# Altium schematic sheet power.SchDoc
size A4; SheetNumber: 3; SheetTotal: 8
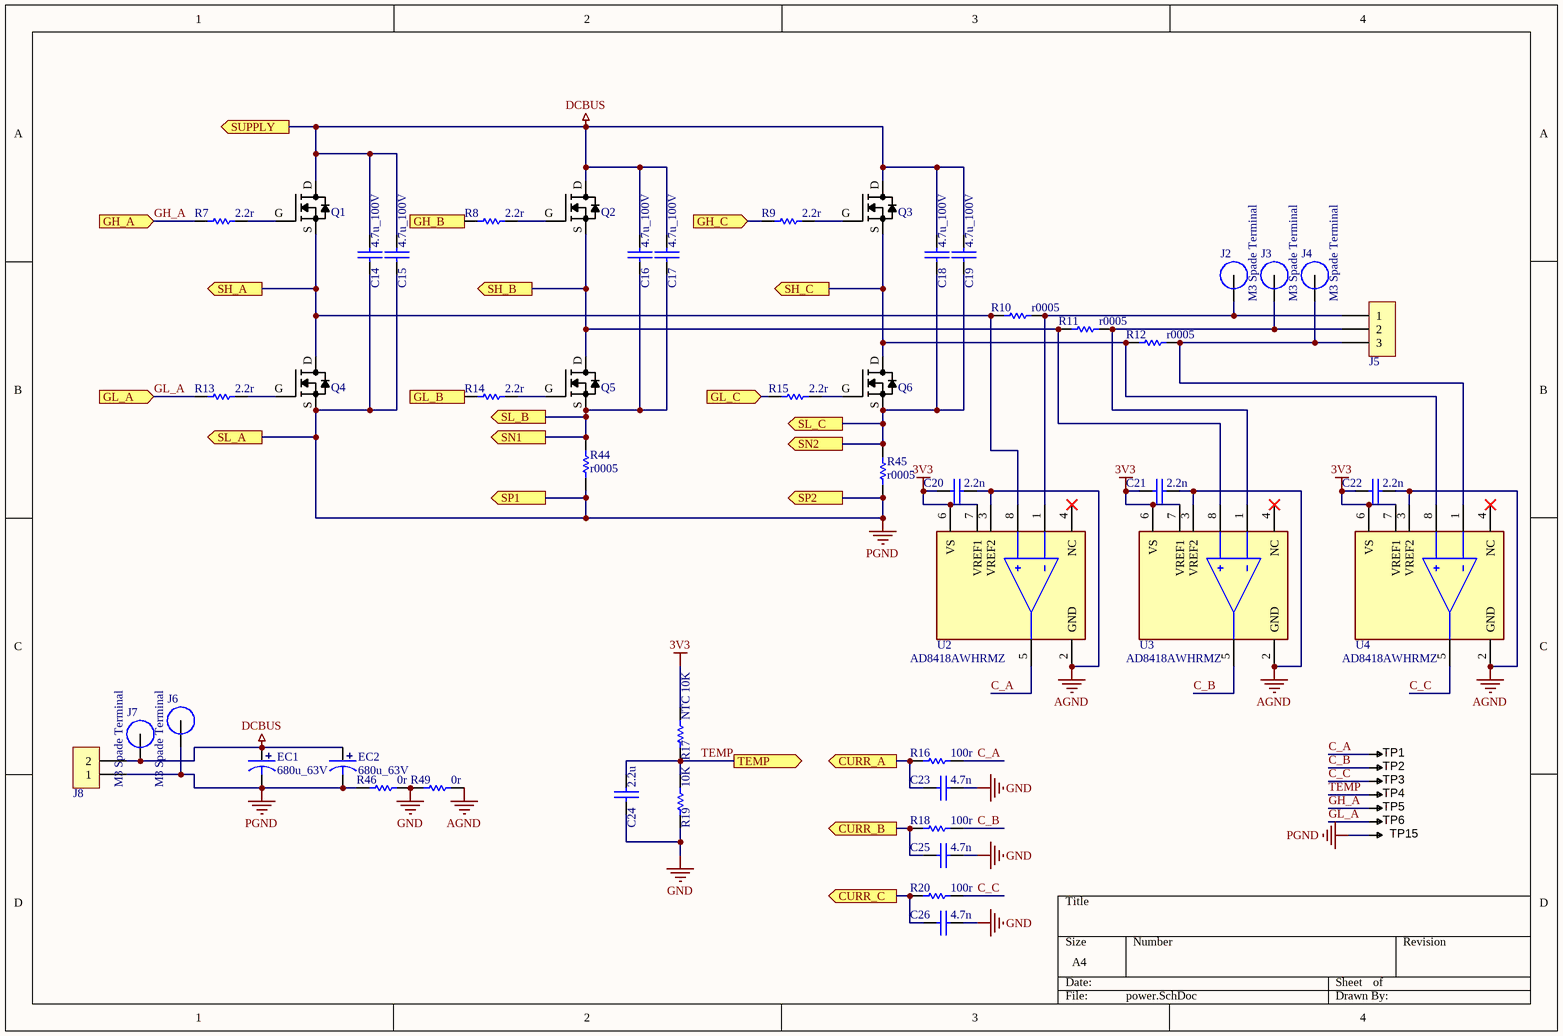
[diagram p0: power.SchDoc]

## Parts
C14  4.7u_100V  [1206C]
C15  4.7u_100V  [1206C]
C16  4.7u_100V  [1206C]
C17  4.7u_100V  [1206C]
C18  4.7u_100V  [1206C]
C19  4.7u_100V  [1206C]
C20  2.2n  [0603C]
C21  2.2n  [0603C]
C22  2.2n  [0603C]
C23  4.7n  [0603C]
C24  2.2u  [0603C]
C25  4.7n  [0603C]
C26  4.7n  [0603C]
EC1  680u_63V  [DIP-EC5.0X12.5X25]
EC2  680u_63V  [DIP-EC5.0X12.5X25]
J2  M3 Spade Terminal  [M3 Spade Hole]
J3  M3 Spade Terminal  [M3 Spade Hole]
J4  M3 Spade Terminal  [M3 Spade Hole]
J5  1704936  [1704936]  (value not drawn)
J6  M3 Spade Terminal  [M3 Spade Hole]
J7  M3 Spade Terminal  [M3 Spade Hole]
J8  1868076  [1868076]  (value not drawn)
Q1  FILL_FOOTPRINT  [SO8FL_VIAS]  (value not drawn)
Q2  FILL_FOOTPRINT  [SO8FL_VIAS]  (value not drawn)
Q3  FILL_FOOTPRINT  [SO8FL_VIAS]  (value not drawn)
Q4  FILL_FOOTPRINT  [SO8FL_VIAS]  (value not drawn)
Q5  FILL_FOOTPRINT  [SO8FL_VIAS]  (value not drawn)
Q6  FILL_FOOTPRINT  [SO8FL_VIAS]  (value not drawn)
R7  2.2r  [0603R]
R8  2.2r  [0603R]
R9  2.2r  [0603R]
R10  r0005  [2512R]
R11  r0005  [2512R]
R12  r0005  [2512R]
R13  2.2r  [0603R]
R14  2.2r  [0603R]
R15  2.2r  [0603R]
R16  100r  [0603R]
R17  NTC 10K  [0603R]
R18  100r  [0603R]
R19  10K  [0603R]
R20  100r  [0603R]
R44  r0005  [2512R]
R45  r0005  [2512R]
R46  0r  [0603R]
R49  0r  [0603R]
TP1  TESTPOINT  [FIDUCIAL]  (value not drawn)  (no BOM)
TP2  TESTPOINT  [FIDUCIAL]  (value not drawn)  (no BOM)
TP3  TESTPOINT  [FIDUCIAL]  (value not drawn)  (no BOM)
TP4  TESTPOINT  [FIDUCIAL]  (value not drawn)  (no BOM)
TP5  TESTPOINT  [FIDUCIAL]  (value not drawn)  (no BOM)
TP6  TESTPOINT  [FIDUCIAL]  (value not drawn)  (no BOM)
TP15  TESTPOINT  [FIDUCIAL]  (value not drawn)  (no BOM)
U2  AD8418AWHRMZ  [FP-RM-8-IPC_A]
U3  AD8418AWHRMZ  [FP-RM-8-IPC_A]
U4  AD8418AWHRMZ  [FP-RM-8-IPC_A]

## Ports
CURR_A (out), CURR_B (out), CURR_C (out), GH_A (in), GH_B (in), GH_C (in), GL_A (in), GL_B (in), GL_C (in), SH_A (out), SH_B (out), SH_C (out), SL_A (out), SL_B (out), SL_C (out), SN1 (out), SN2 (out), SP1 (out), SP2 (out), SUPPLY (out), TEMP (out)

## Nets
3V3: C20.2 C21.2 C22.2 R17.2 U2.6(VS) U2.7(VREF1) U3.6(VS) U3.7(VREF1) U4.6(VS) U4.7(VREF1)
AGND: C20.1 C21.1 C22.1 R49.1 U2.2(GND) U2.3(VREF2) U3.2(GND) U3.3(VREF2) U4.2(GND) U4.3(VREF2)
DCBUS: C14.2 C15.2 C16.2 C17.2 C18.2 C19.2 EC1.1 EC2.1 J7.1 J8.2 Q1.D Q2.D Q3.D ; port SUPPLY
GND: C23.1 C24.1 C25.1 C26.1 R19.1 R46.1 R49.2
PGND: C14.1 C15.1 EC1.2 EC2.2 J6.1 J8.1 Q4.S R44.2 R45.2 R46.2 TP15.1 ; port SL_A, port SP1, port SP2
C_A: R16.1 TP1.1 U2.5(OUT)
C_B: R18.1 TP2.1 U3.5(OUT)
C_C: R20.1 TP3.1 U4.5(OUT)
CURR_A: C23.2 R16.2 ; port CURR_A
CURR_B: C25.2 R18.2 ; port CURR_B
CURR_C: C26.2 R20.2 ; port CURR_C
GH_A: R7.1 TP5.1 ; port GH_A
GH_B: R8.1 ; port GH_B
GH_C: R9.1 ; port GH_C
GL_A: R13.1 TP6.1 ; port GL_A
GL_B: R14.1 ; port GL_B
GL_C: R15.1 ; port GL_C
SH_A: Q1.S Q4.D R10.2 U2.8(+IN) ; port SH_A
SH_B: Q2.S Q5.D R11.2 U3.8(+IN) ; port SH_B
SH_C: Q3.S Q6.D R12.2 U4.8(+IN) ; port SH_C
SL_B: C16.1 C17.1 Q5.S R44.1 ; port SL_B, port SN1
SL_C: C18.1 C19.1 Q6.S R45.1 ; port SL_C, port SN2
TEMP: C24.2 R17.1 R19.2 TP4.1 ; port TEMP
NetJ2_1: J2.1 J5.1 R10.1 U2.1(-IN)
NetJ3_1: J3.1 J5.2 R11.1 U3.1(-IN)
NetJ4_1: J4.1 J5.3 R12.1 U4.1(-IN)
NetQ1_G: Q1.G R7.2
NetQ2_G: Q2.G R8.2
NetQ3_G: Q3.G R9.2
NetQ4_G: Q4.G R13.2
NetQ5_G: Q5.G R14.2
NetQ6_G: Q6.G R15.2

Not connected (* = marked no-connect by the designer): U2 4(NC)*; U3 4(NC)*; U4 4(NC)*

## Library data of the parts
C14-C26 = CAP: 无极性电容
EC1 EC2 = DIP_ECAP: 直插电解电容
J5 = 1704936: CONN TERM BLOCK 3POS 7.62MM; Manufacturer: Phoenix Contact; Number of Levels: 1; Positions Per Level: 3; Pitch: 0.300" (7.62mm); Mating Orientation: Horizontal with Board; Current: 30A; Voltage: 300V; Wire Gauge: 10-30 AWG; Wire Termination: Screw - Rising Cage Clamp; Torque - Screw: 0.5-0.6 Nm (4.4-5.3 Lb-In); Screw Thread: M3; Supplier 1: Digi-Key; Supplier Part Number 1: 277-5954-ND; RoHS: RoHS Compliant; Category: Connectors, Interconnects; Stock: 3559; Pricing 1: 1=2.19, 10=2.128, 50=1.989, 100=1.8299, 250=1.69064, 500=1.61108, 1000=1.482 (USD); Packaging: Bulk; Part Status: Active; Mounting Type: Through Hole; Features: Interlocking (Side); Color: Green; Operating Temperature: -; Housing Material: Polyamide (PA), Nylon; Contact Material - Plating: -; Clamp Material - Plating: -; Screw Material - Plating: -; ComponentLink1URL: http://media.digikey.com/PDF/Data%20Sheets/Phoenix%20Contact%20PDFs/1704936.pdf; ComponentLink1Description: http://media.digikey.com/PDF/Data%20Sheets/Phoenix%20Contact%20PDFs/1704936.pdf; Manufacturer Part Number: 1704936
J8 = 1868076: CONN TERM BLOCK 2POS 7.62MM; Manufacturer: Phoenix Contact; Number of Levels: 1; Positions Per Level: 2; Pitch: 0.300" (7.62mm); Mating Orientation: Horizontal with Board; Current: 30A; Voltage: 300V; Wire Gauge: 10-30 AWG; Wire Termination: Screw - Rising Cage Clamp; Torque - Screw: 0.5-0.6 Nm (4.4-5.3 Lb-In); Screw Thread: M3; Supplier 1: Digi-Key; Supplier Part Number 1: 277-5840-ND; RoHS: RoHS Compliant; Category: Connectors, Interconnects; Stock: 2175; Pricing 1: 1=1.56, 10=1.517, 50=1.4178, 100=1.3044, 250=1.20512, 500=1.14842, 1000=1.0564 (USD); Packaging: Bulk; Part Status: Active; Mounting Type: Through Hole; Features: Interlocking (Side); Color: Green; Operating Temperature: -; Housing Material: Polyamide (PA), Nylon; Contact Material - Plating: -; Clamp Material - Plating: -; Screw Material - Plating: -; ComponentLink1URL: http://media.digikey.com/PDF/Data%20Sheets/Phoenix%20Contact%20PDFs/1868076.pdf; ComponentLink1Description: http://media.digikey.com/PDF/Data%20Sheets/Phoenix%20Contact%20PDFs/1868076.pdf
Q1-Q6 = NTMFS4935NT1G_1: MOSFET N-CH 30V 13A SO8FL; Manufacturer: ON Semiconductor; FET Type: N-Channel; Current - Continuous Drain (Id) @ 25°C: 13A (Ta), 93A (Tc); Drive Voltage (Max Rds On,  Min Rds On): 4.5V, 10V; Vgs(th) (Max) @ Id: 2.2V @ 250µA; Gate Charge (Qg) (Max) @ Vgs: 49.4nC @ 10V; Input Capacitance (Ciss) (Max) @ Vds: 4850pF @ 15V; Vgs (Max): ±20V; Power Dissipation (Max): 930mW (Ta), 48W (Tc); Rds On (Max) @ Id, Vgs: 3.2 mOhm @ 30A, 10V; Supplier 1: Digi-Key; Supplier Part Number 1: NTMFS4935NT1GOSCT-ND; RoHS: RoHS Compliant; Category: Discrete Semiconductor Products; Stock 1: 932; Pricing 1: 1=0.61, 10=0.541, 100=0.4145, 500=0.3277 (USD); Packaging: Cut Tape (CT); Part Status: Active; Technology: MOSFET (Metal Oxide); Drain to Source Voltage (Vdss): 30V; FET Feature: -; Operating Temperature: -55°C ~ 150°C (TJ); Mounting Type: Surface Mount; Supplier Device Package: 5-DFN (5x6) (8-SOFL); Package / Case: 8-PowerTDFN, 5 Leads; ComponentLink1URL: http://www.onsemi.com/pub_link/Collateral/NTMFS4935N-D.PDF; ComponentLink1Description: http://www.onsemi.com/pub_link/Collateral/NTMFS4935N-D.PDF; Manufacturer Part Number: NTMFS4935NT1G
R7-R20 R44-R46 R49 = RES
TP1-TP6 TP15 = TESTPOINT: SMD test pin
U2-U4 = CMP-09116-000167-1: IC CURR SENSE 1 CIRCUIT 8MSOP; Input Offset Voltage (Vos): 200uV; Number of Circuits: 1; Operating Supply Current: 4.1mA; Common Mode Rejection Ratio: 90dB; Input Bias Current: 130uA; Min Dual Supply Voltage: 1.35V; Max Dual Supply Voltage: 2.75V; Slew Rate: 1V/µs; Min Supply Voltage: 2.7V; Max Supply Voltage: 5.5V; -3db Bandwidth: 250kHz; Power Supply Rejection Ratio (PSRR): 80dB; Input Capacitance: 2pF; Number of Pins: 8; Max Operating Temperature: 125°C; Lead Free: Contains Lead; Mount: Surface Mount; Case/Package: MSOP; Min Operating Temperature: -40°C; Contact Plating: Tin; Packaging: Rail/Tube; RoHS Compliant: Yes